# Altium schematic sheet main2020.SchDoc
size A1
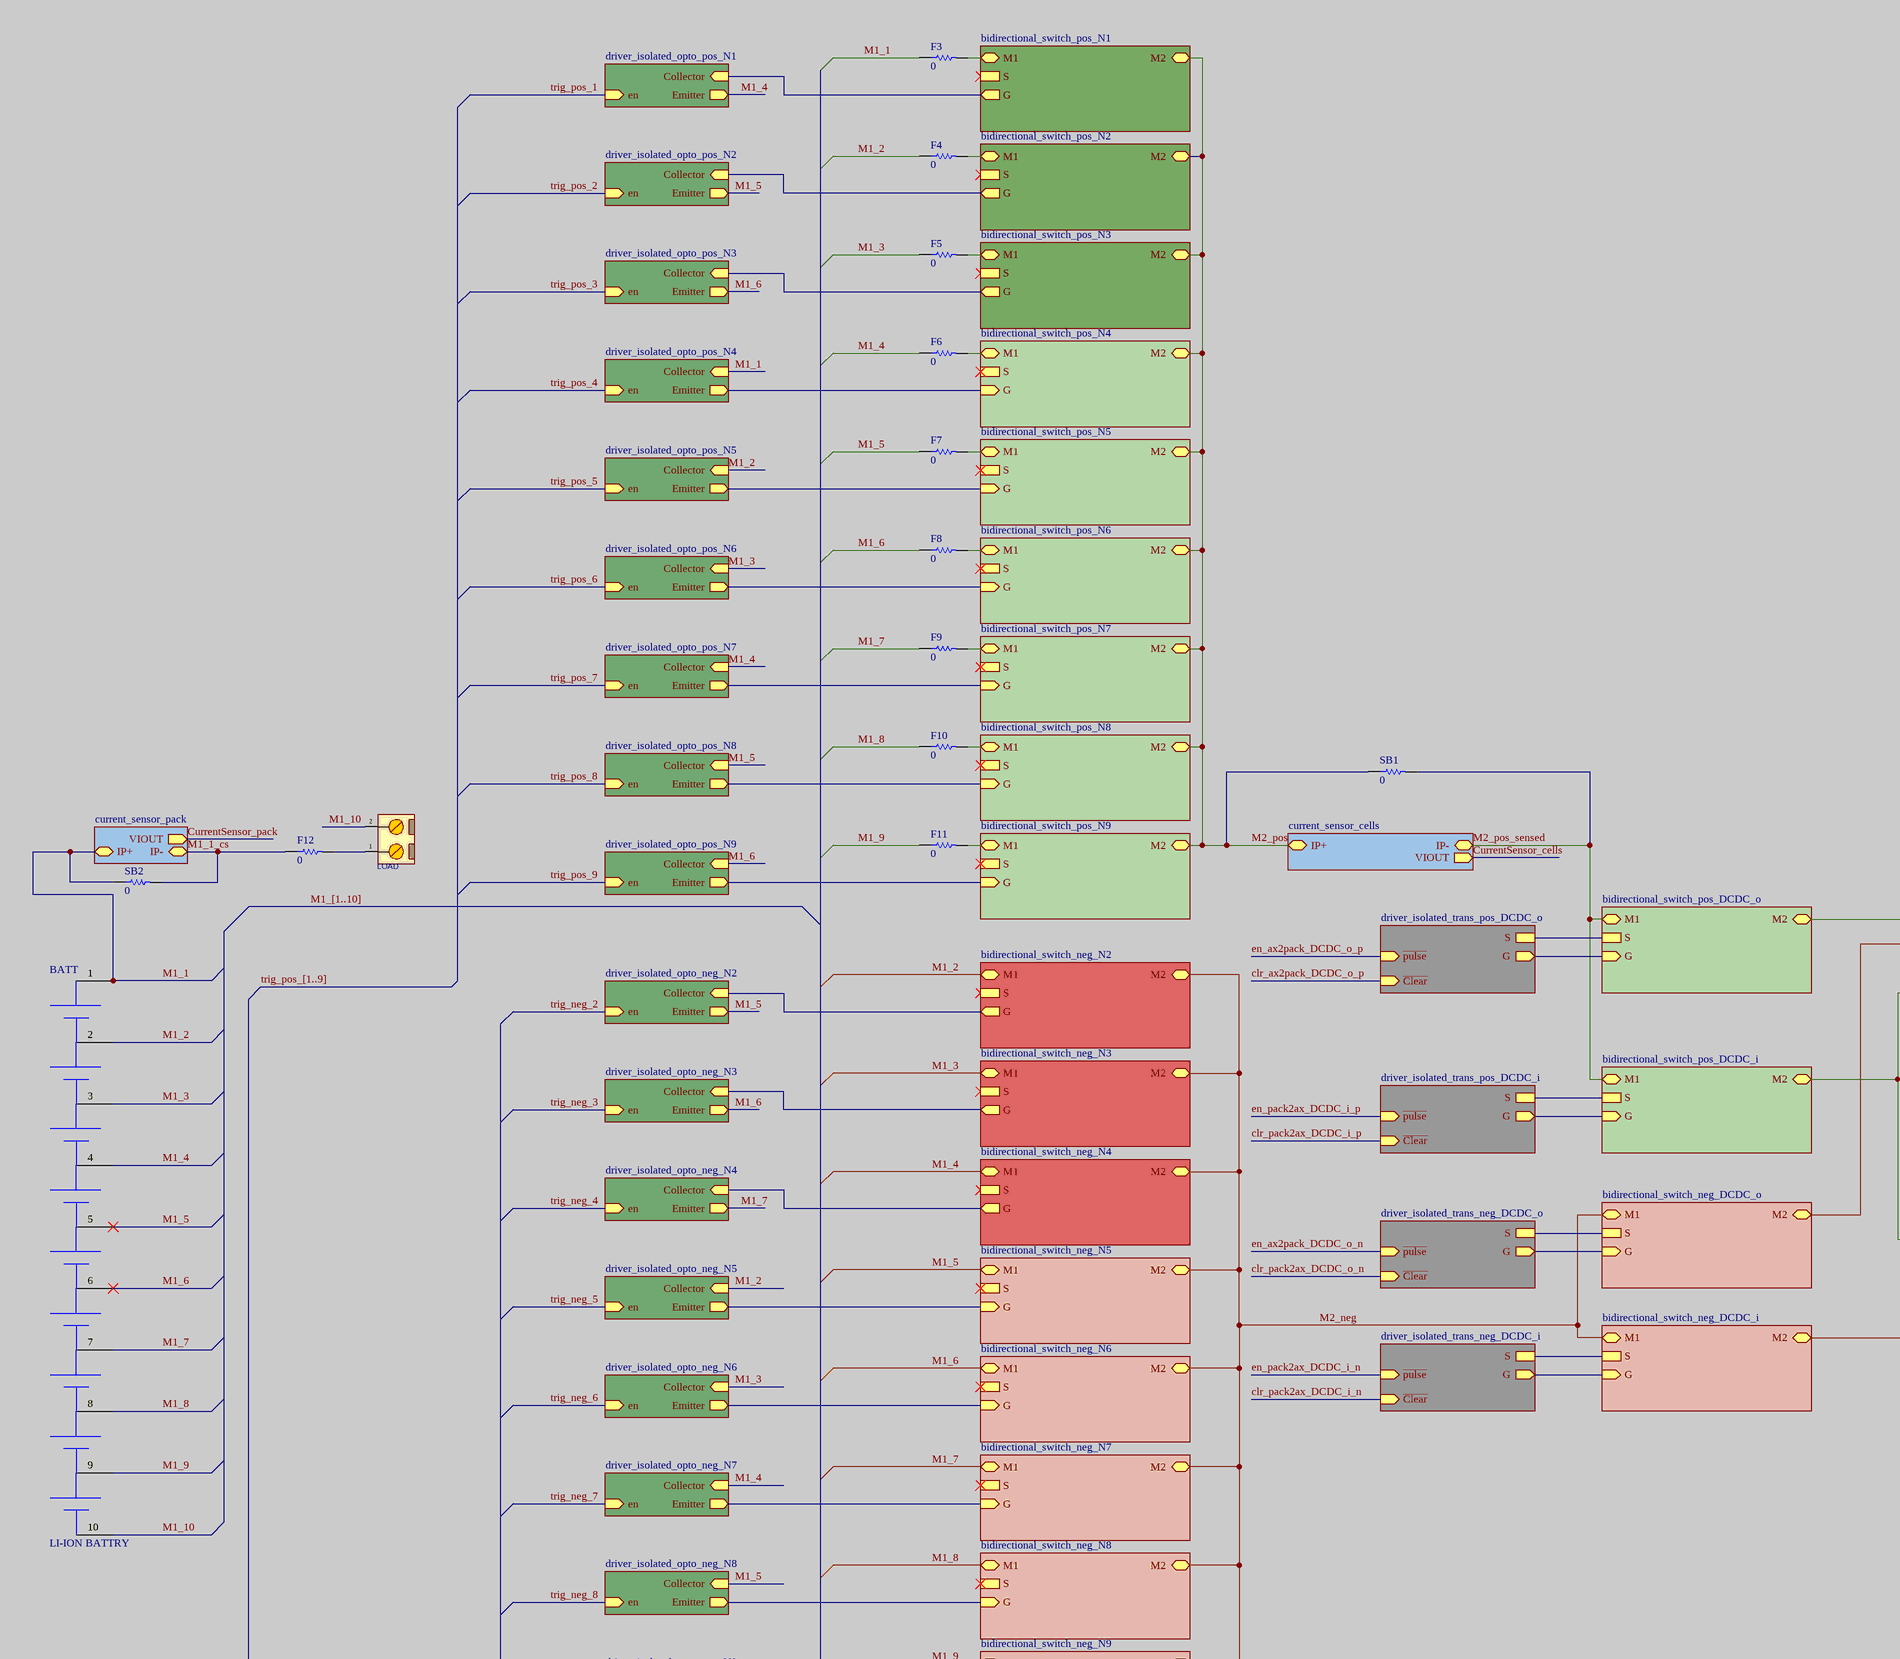
[diagram p0: main2020.SchDoc, top left]
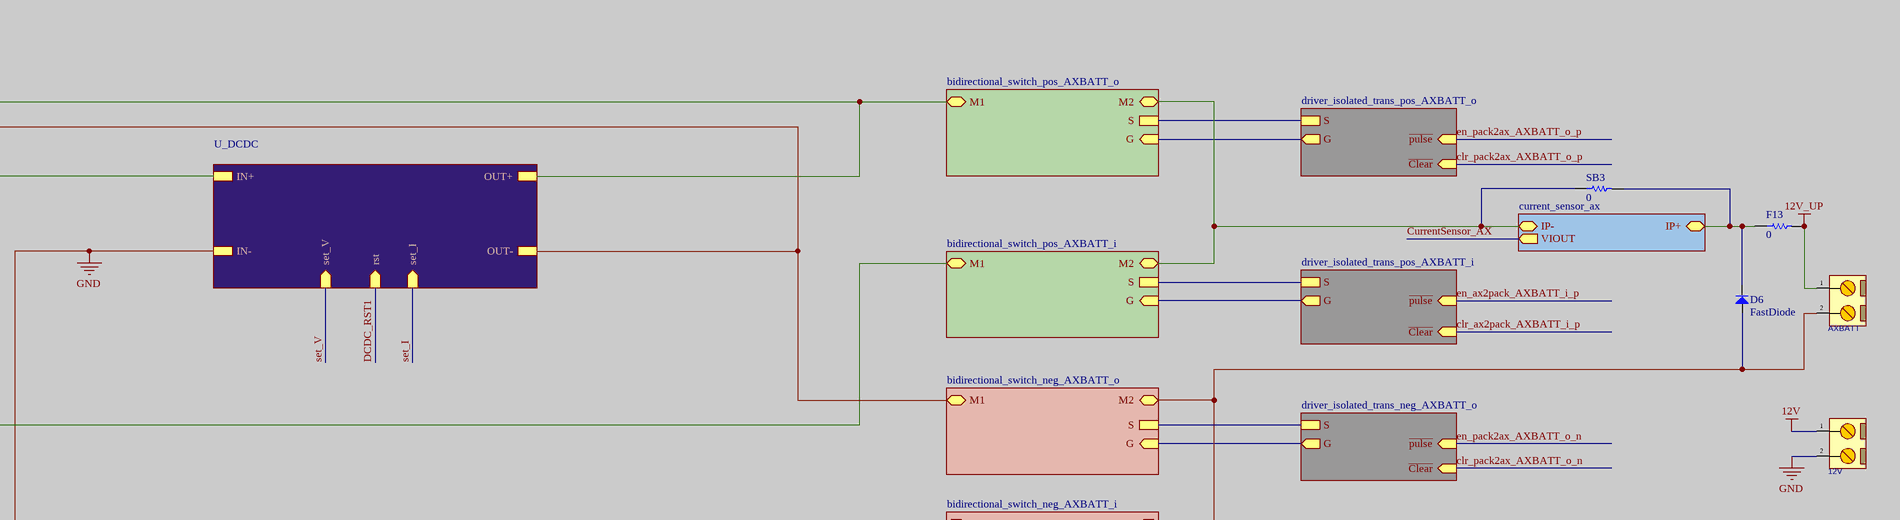
[diagram p1: main2020.SchDoc, top right]
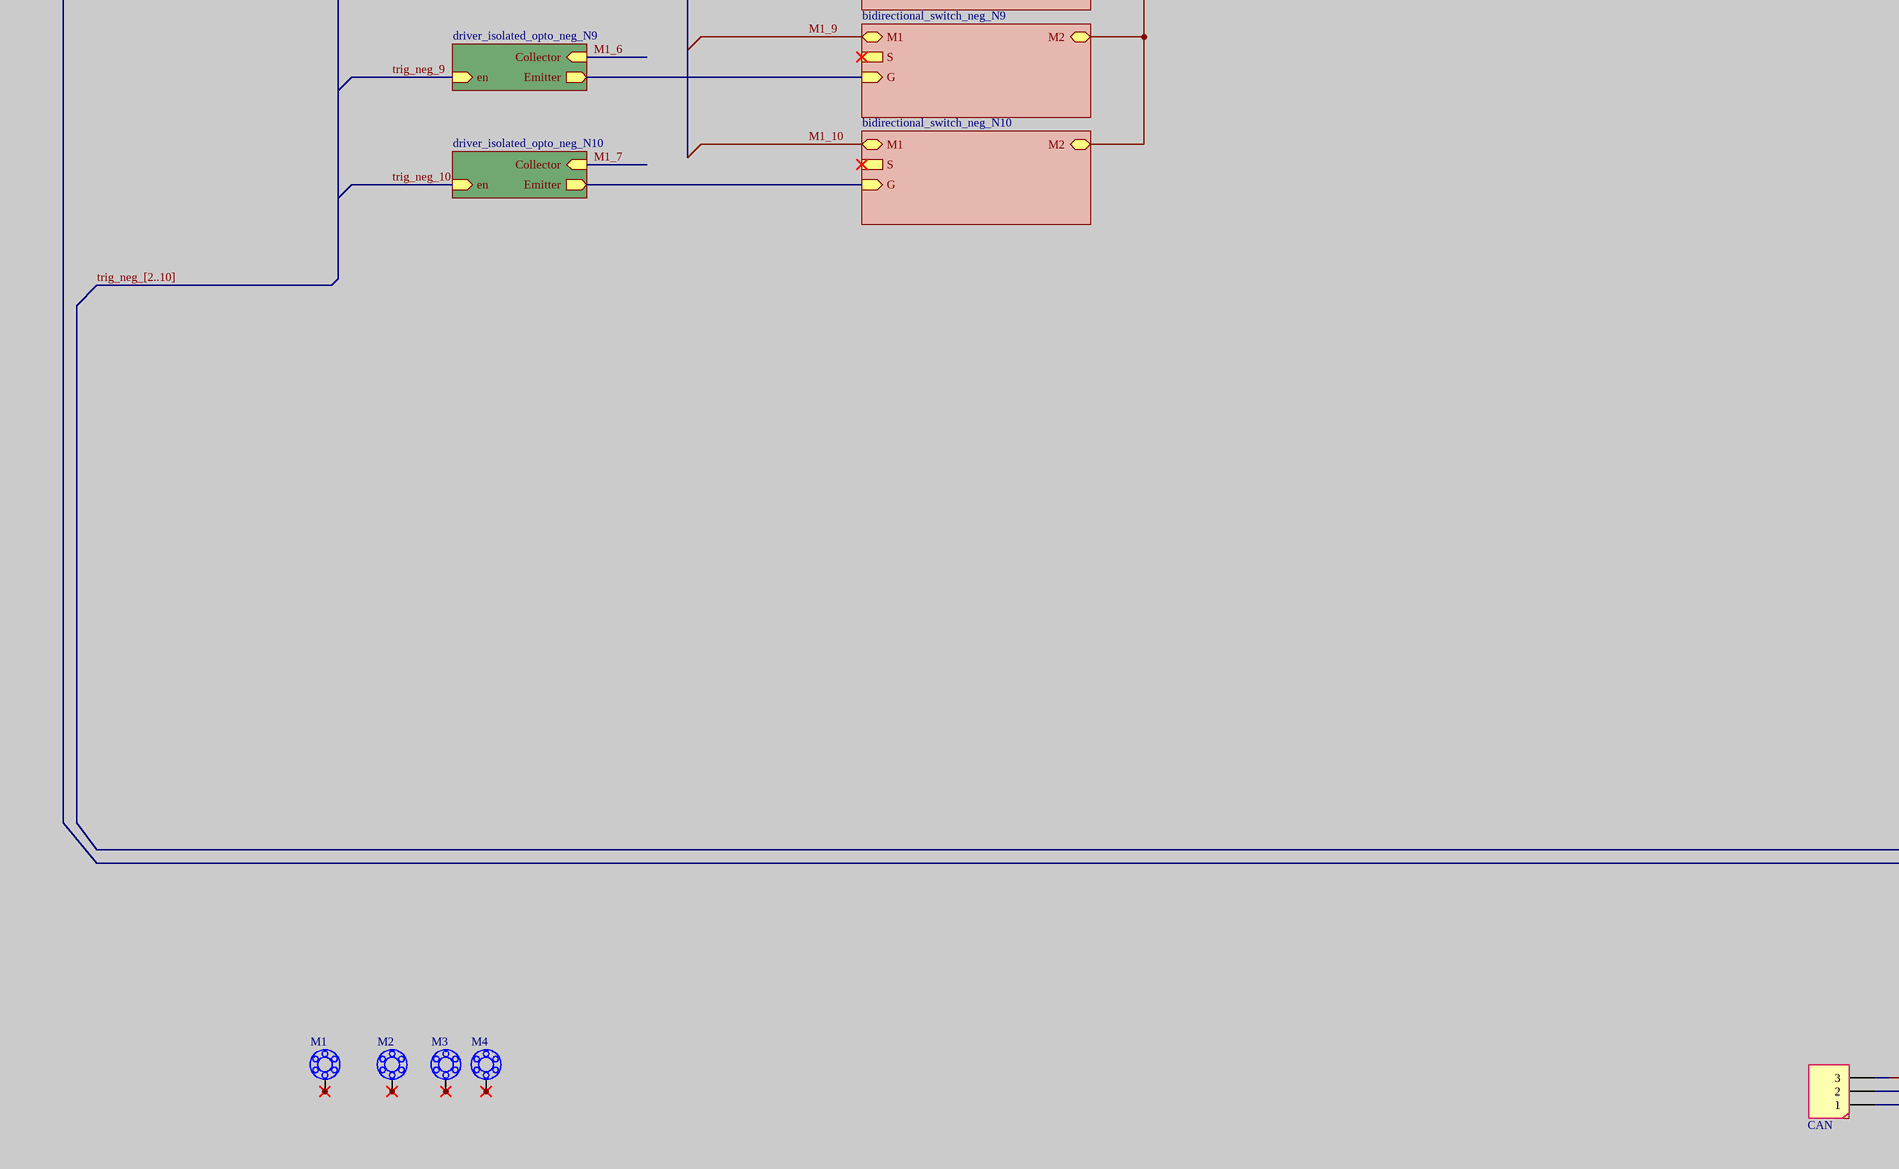
[diagram p2: main2020.SchDoc, bottom left]
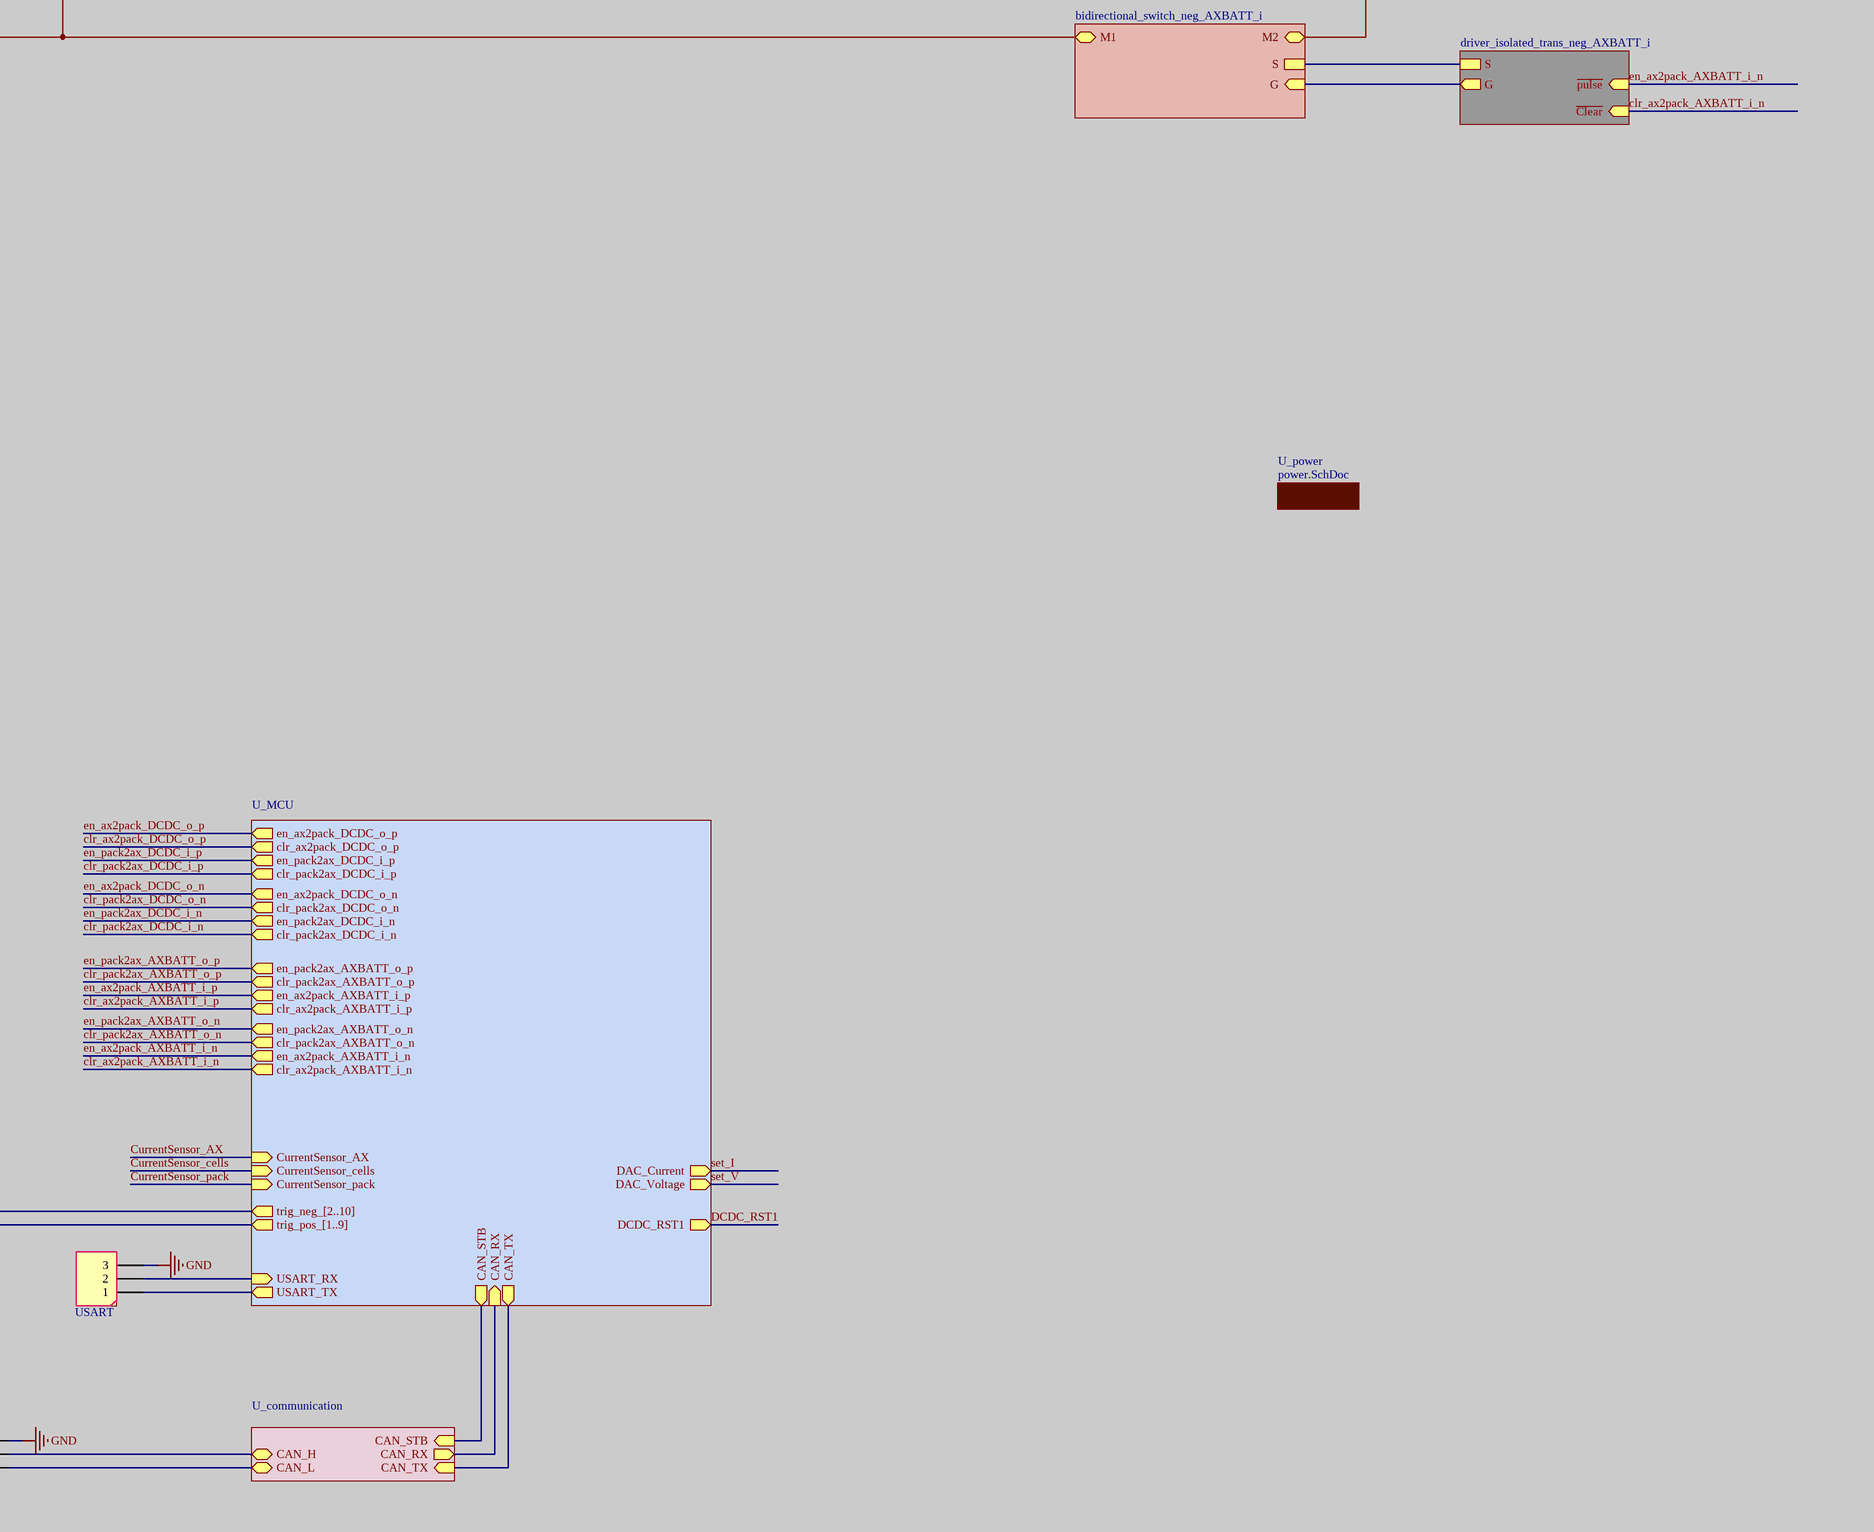
[diagram p3: main2020.SchDoc, bottom right]

## Parts
12V  CONN_TB8  [terminal block - 2828372]  (value not drawn)
AXBATT  CONN_TB8  [terminal block - 2828372]  (value not drawn)
BATT  LI-ION BATTRY  [terminal block - battery - 2828372 -]
CAN  DCDC_CTRL  [HEADER1*3]  (value not drawn)
D6  FastDiode  [FastDiode]
F3  0  [RESC0603]
F4  0  [RESC0603]
F5  0  [RESC0603]
F6  0  [RESC0603]
F7  0  [RESC0603]
F8  0  [RESC0603]
F9  0  [RESC0603]
F10  0  [RESC0603]
F11  0  [RESC0603]
F12  0  [RESC0603]
F13  0  [RESC0603]
LOAD  CONN_TB8  [terminal block - 2828372]  (value not drawn)
M1  M  [MOUNTING]  (value not drawn)  (no BOM)
M2  M  [MOUNTING]  (value not drawn)  (no BOM)
M3  M  [MOUNTING]  (value not drawn)  (no BOM)
M4  M  [MOUNTING]  (value not drawn)  (no BOM)
SB1  0  [RESC0603]
SB2  0  [RESC0603]
SB3  0  [RESC0603]
USART  DCDC_CTRL  [HEADER1*3]  (value not drawn)

## Sub-sheets
bidirectional_switch_neg_AXBATT_i = bidirectional_switch_N.SchDoc: M1 (bidir), M2 (bidir), G (in), S
bidirectional_switch_neg_AXBATT_o = bidirectional_switch_N.SchDoc: M1 (bidir), M2 (bidir), G (in), S
bidirectional_switch_neg_DCDC_i = bidirectional_switch_N.SchDoc: M1 (bidir), M2 (bidir), G (in), S
bidirectional_switch_neg_DCDC_o = bidirectional_switch_N.SchDoc: M1 (bidir), M2 (bidir), G (in), S
bidirectional_switch_neg_N2 = bidirectional_switch.SchDoc: M1 (bidir), M2 (bidir), S, G (out)
bidirectional_switch_neg_N3 = bidirectional_switch.SchDoc: M1 (bidir), M2 (bidir), S, G (out)
bidirectional_switch_neg_N4 = bidirectional_switch.SchDoc: M1 (bidir), M2 (bidir), S, G (out)
bidirectional_switch_neg_N5 = bidirectional_switch_N.SchDoc: M1 (bidir), M2 (bidir), G (in), S
bidirectional_switch_neg_N6 = bidirectional_switch_N.SchDoc: M1 (bidir), M2 (bidir), G (in), S
bidirectional_switch_neg_N7 = bidirectional_switch_N.SchDoc: M1 (bidir), M2 (bidir), G (in), S
bidirectional_switch_neg_N8 = bidirectional_switch_N.SchDoc: M1 (bidir), M2 (bidir), G (in), S
bidirectional_switch_neg_N9 = bidirectional_switch_N.SchDoc: M1 (bidir), M2 (bidir), G (in), S
bidirectional_switch_neg_N10 = bidirectional_switch_N.SchDoc: M1 (bidir), M2 (bidir), G (in), S
bidirectional_switch_pos_AXBATT_i = bidirectional_switch_N.SchDoc: M1 (bidir), M2 (bidir), G (in), S
bidirectional_switch_pos_AXBATT_o = bidirectional_switch_N.SchDoc: M1 (bidir), M2 (bidir), G (in), S
bidirectional_switch_pos_DCDC_i = bidirectional_switch_N.SchDoc: M1 (bidir), M2 (bidir), G (in), S
bidirectional_switch_pos_DCDC_o = bidirectional_switch_N.SchDoc: M1 (bidir), M2 (bidir), G (in), S
bidirectional_switch_pos_N1 = bidirectional_switch.SchDoc: M1 (bidir), M2 (bidir), S, G (out)
bidirectional_switch_pos_N2 = bidirectional_switch.SchDoc: M1 (bidir), M2 (bidir), S, G (out)
bidirectional_switch_pos_N3 = bidirectional_switch.SchDoc: M1 (bidir), M2 (bidir), S, G (out)
bidirectional_switch_pos_N4 = bidirectional_switch_N.SchDoc: M1 (bidir), M2 (bidir), G (in), S
bidirectional_switch_pos_N5 = bidirectional_switch_N.SchDoc: M1 (bidir), M2 (bidir), G (in), S
bidirectional_switch_pos_N6 = bidirectional_switch_N.SchDoc: M1 (bidir), M2 (bidir), G (in), S
bidirectional_switch_pos_N7 = bidirectional_switch_N.SchDoc: M1 (bidir), M2 (bidir), G (in), S
bidirectional_switch_pos_N8 = bidirectional_switch_N.SchDoc: M1 (bidir), M2 (bidir), G (in), S
bidirectional_switch_pos_N9 = bidirectional_switch_N.SchDoc: M1 (bidir), M2 (bidir), G (in), S
current_sensor_ax = current_sensor.SchDoc: IP+ (bidir), IP- (bidir), VIOUT (out)
current_sensor_cells = current_sensor.SchDoc: IP+ (bidir), IP- (bidir), VIOUT (out)
current_sensor_pack = current_sensor.SchDoc: IP+ (bidir), IP- (bidir), VIOUT (out)
driver_isolated_opto_neg_N2 = driver_isolated_opto.SchDoc: en (in), Emitter (out), Collector (in)
driver_isolated_opto_neg_N3 = driver_isolated_opto.SchDoc: en (in), Emitter (out), Collector (in)
driver_isolated_opto_neg_N4 = driver_isolated_opto.SchDoc: en (in), Emitter (out), Collector (in)
driver_isolated_opto_neg_N5 = driver_isolated_opto.SchDoc: en (in), Emitter (out), Collector (in)
driver_isolated_opto_neg_N6 = driver_isolated_opto.SchDoc: en (in), Emitter (out), Collector (in)
driver_isolated_opto_neg_N7 = driver_isolated_opto.SchDoc: en (in), Emitter (out), Collector (in)
driver_isolated_opto_neg_N8 = driver_isolated_opto.SchDoc: en (in), Emitter (out), Collector (in)
driver_isolated_opto_neg_N9 = driver_isolated_opto.SchDoc: en (in), Emitter (out), Collector (in)
driver_isolated_opto_neg_N10 = driver_isolated_opto.SchDoc: en (in), Emitter (out), Collector (in)
driver_isolated_opto_pos_N1 = driver_isolated_opto.SchDoc: en (in), Emitter (out), Collector (in)
driver_isolated_opto_pos_N2 = driver_isolated_opto.SchDoc: en (in), Emitter (out), Collector (in)
driver_isolated_opto_pos_N3 = driver_isolated_opto.SchDoc: en (in), Emitter (out), Collector (in)
driver_isolated_opto_pos_N4 = driver_isolated_opto.SchDoc: en (in), Emitter (out), Collector (in)
driver_isolated_opto_pos_N5 = driver_isolated_opto.SchDoc: en (in), Emitter (out), Collector (in)
driver_isolated_opto_pos_N6 = driver_isolated_opto.SchDoc: en (in), Emitter (out), Collector (in)
driver_isolated_opto_pos_N7 = driver_isolated_opto.SchDoc: en (in), Emitter (out), Collector (in)
driver_isolated_opto_pos_N8 = driver_isolated_opto.SchDoc: en (in), Emitter (out), Collector (in)
driver_isolated_opto_pos_N9 = driver_isolated_opto.SchDoc: en (in), Emitter (out), Collector (in)
driver_isolated_trans_neg_AXBATT_i = driver_isolated_trans.SchDoc: ~{pulse} (in), G (out), S, ~{Clear} (in)
driver_isolated_trans_neg_AXBATT_o = driver_isolated_trans.SchDoc: ~{pulse} (in), G (out), S, ~{Clear} (in)
driver_isolated_trans_neg_DCDC_i = driver_isolated_trans.SchDoc: ~{pulse} (in), G (out), S, ~{Clear} (in)
driver_isolated_trans_neg_DCDC_o = driver_isolated_trans.SchDoc: ~{pulse} (in), G (out), S, ~{Clear} (in)
driver_isolated_trans_pos_AXBATT_i = driver_isolated_trans.SchDoc: ~{pulse} (in), G (out), S, ~{Clear} (in)
driver_isolated_trans_pos_AXBATT_o = driver_isolated_trans.SchDoc: ~{pulse} (in), G (out), S, ~{Clear} (in)
driver_isolated_trans_pos_DCDC_i = driver_isolated_trans.SchDoc: ~{pulse} (in), G (out), S, ~{Clear} (in)
driver_isolated_trans_pos_DCDC_o = driver_isolated_trans.SchDoc: ~{pulse} (in), G (out), S, ~{Clear} (in)
U_communication = communication.SchDoc: CAN_TX (in), CAN_RX (out), CAN_H (bidir), CAN_L (bidir), CAN_STB (in)
U_DCDC = DCDC.SchDoc: IN+, IN-, OUT+, OUT-, set_V (in), set_I (in), rst (in)
U_MCU = MCU.SchDoc: DAC_Current (out), DAC_Voltage (out), USART_TX (out), USART_RX (in), DCDC_RST1 (out), CAN_TX (out), CAN_RX (in), CAN_STB (out), trig_pos_[1..9] (out), trig_neg_[2..10] (out), CurrentSensor_AX (in), CurrentSensor_cells (in), CurrentSensor_pack (in), en_ax2pack_DCDC_o_p (out), clr_ax2pack_DCDC_o_p (out), en_pack2ax_DCDC_i_p (out), clr_pack2ax_DCDC_i_p (out), en_ax2pack_DCDC_o_n (out), clr_pack2ax_DCDC_o_n (out), en_pack2ax_DCDC_i_n (out), clr_pack2ax_DCDC_i_n (out), en_pack2ax_AXBATT_o_p (out), clr_pack2ax_AXBATT_o_p (out), en_ax2pack_AXBATT_i_p (out), clr_ax2pack_AXBATT_i_p (out), en_pack2ax_AXBATT_o_n (out), clr_pack2ax_AXBATT_o_n (out), en_ax2pack_AXBATT_i_n (out), clr_ax2pack_AXBATT_i_n (out)
U_power = power.SchDoc: no entries

## Nets
12V: 12V.1
12V_UP: AXBATT.1 F13.2
GND: 12V.2 CAN.3 USART.3 ; sheet U_DCDC/IN-, sheet bidirectional_switch_neg_DCDC_i/M2, sheet bidirectional_switch_neg_AXBATT_i/M1
clr_ax2pack_AXBATT_i_n: sheet U_MCU/clr_ax2pack_AXBATT_i_n, sheet driver_isolated_trans_neg_AXBATT_i/~{Clear}
clr_ax2pack_AXBATT_i_p: sheet U_MCU/clr_ax2pack_AXBATT_i_p, sheet driver_isolated_trans_pos_AXBATT_i/~{Clear}
clr_ax2pack_DCDC_o_p: sheet U_MCU/clr_ax2pack_DCDC_o_p, sheet driver_isolated_trans_pos_DCDC_o/~{Clear}
clr_pack2ax_AXBATT_o_n: sheet U_MCU/clr_pack2ax_AXBATT_o_n, sheet driver_isolated_trans_neg_AXBATT_o/~{Clear}
clr_pack2ax_AXBATT_o_p: sheet U_MCU/clr_pack2ax_AXBATT_o_p, sheet driver_isolated_trans_pos_AXBATT_o/~{Clear}
clr_pack2ax_DCDC_i_n: sheet U_MCU/clr_pack2ax_DCDC_i_n, sheet driver_isolated_trans_neg_DCDC_i/~{Clear}
clr_pack2ax_DCDC_i_p: sheet U_MCU/clr_pack2ax_DCDC_i_p, sheet driver_isolated_trans_pos_DCDC_i/~{Clear}
clr_pack2ax_DCDC_o_n: sheet U_MCU/clr_pack2ax_DCDC_o_n, sheet driver_isolated_trans_neg_DCDC_o/~{Clear}
CurrentSensor_AX: sheet current_sensor_ax/VIOUT, sheet U_MCU/CurrentSensor_AX
CurrentSensor_cells: sheet current_sensor_cells/VIOUT, sheet U_MCU/CurrentSensor_cells
CurrentSensor_pack: sheet U_MCU/CurrentSensor_pack, sheet current_sensor_pack/VIOUT
DCDC_RST1: sheet U_MCU/DCDC_RST1, sheet U_DCDC/rst
en_ax2pack_AXBATT_i_n: sheet U_MCU/en_ax2pack_AXBATT_i_n, sheet driver_isolated_trans_neg_AXBATT_i/~{pulse}
en_ax2pack_AXBATT_i_p: sheet U_MCU/en_ax2pack_AXBATT_i_p, sheet driver_isolated_trans_pos_AXBATT_i/~{pulse}
en_ax2pack_DCDC_o_n: sheet U_MCU/en_ax2pack_DCDC_o_n, sheet driver_isolated_trans_neg_DCDC_o/~{pulse}
en_ax2pack_DCDC_o_p: sheet U_MCU/en_ax2pack_DCDC_o_p, sheet driver_isolated_trans_pos_DCDC_o/~{pulse}
en_pack2ax_AXBATT_o_n: sheet U_MCU/en_pack2ax_AXBATT_o_n, sheet driver_isolated_trans_neg_AXBATT_o/~{pulse}
en_pack2ax_AXBATT_o_p: sheet U_MCU/en_pack2ax_AXBATT_o_p, sheet driver_isolated_trans_pos_AXBATT_o/~{pulse}
en_pack2ax_DCDC_i_n: sheet U_MCU/en_pack2ax_DCDC_i_n, sheet driver_isolated_trans_neg_DCDC_i/~{pulse}
en_pack2ax_DCDC_i_p: sheet U_MCU/en_pack2ax_DCDC_i_p, sheet driver_isolated_trans_pos_DCDC_i/~{pulse}
M1_1: BATT.1 F3.1 SB2.1 ; sheet current_sensor_pack/IP+, sheet driver_isolated_opto_pos_N4/Collector
M1_1_cs: F12.1 SB2.2 ; sheet current_sensor_pack/IP-
M1_2: BATT.2 F4.1 ; sheet driver_isolated_opto_pos_N5/Collector, sheet driver_isolated_opto_neg_N5/Collector, sheet bidirectional_switch_neg_N2/M1
M1_3: BATT.3 F5.1 ; sheet driver_isolated_opto_pos_N6/Collector, sheet driver_isolated_opto_neg_N6/Collector, sheet bidirectional_switch_neg_N3/M1
M1_4: BATT.4 F6.1 ; sheet driver_isolated_opto_pos_N7/Collector, sheet driver_isolated_opto_neg_N7/Collector, sheet driver_isolated_opto_pos_N1/Emitter, sheet bidirectional_switch_neg_N4/M1
M1_5: BATT.5 F7.1 ; sheet bidirectional_switch_neg_N5/M1, sheet driver_isolated_opto_pos_N8/Collector, sheet driver_isolated_opto_neg_N8/Collector, sheet driver_isolated_opto_pos_N2/Emitter, sheet driver_isolated_opto_neg_N2/Emitter
M1_6: BATT.6 F8.1 ; sheet bidirectional_switch_neg_N6/M1, sheet driver_isolated_opto_pos_N9/Collector, sheet driver_isolated_opto_neg_N9/Collector, sheet driver_isolated_opto_pos_N3/Emitter, sheet driver_isolated_opto_neg_N3/Emitter
M1_7: BATT.7 F9.1 ; sheet bidirectional_switch_neg_N7/M1, sheet driver_isolated_opto_neg_N10/Collector, sheet driver_isolated_opto_neg_N4/Emitter
M1_8: BATT.8 F10.1 ; sheet bidirectional_switch_neg_N8/M1
M1_9: BATT.9 F11.1 ; sheet bidirectional_switch_neg_N9/M1
M1_10: BATT.10 LOAD.2 ; sheet bidirectional_switch_neg_N10/M1
M2_neg: sheet bidirectional_switch_neg_N5/M2, sheet bidirectional_switch_neg_N6/M2, sheet bidirectional_switch_neg_N7/M2, sheet bidirectional_switch_neg_N8/M2, sheet bidirectional_switch_neg_N9/M2, sheet bidirectional_switch_neg_N10/M2, sheet bidirectional_switch_neg_N2/M2, sheet bidirectional_switch_neg_N3/M2, sheet bidirectional_switch_neg_N4/M2, sheet bidirectional_switch_neg_DCDC_o/M1, sheet bidirectional_switch_neg_DCDC_i/M1
M2_pos: SB1.1 ; sheet current_sensor_cells/IP+, sheet bidirectional_switch_pos_N4/M2, sheet bidirectional_switch_pos_N5/M2, sheet bidirectional_switch_pos_N6/M2, sheet bidirectional_switch_pos_N7/M2, sheet bidirectional_switch_pos_N8/M2, sheet bidirectional_switch_pos_N9/M2, sheet bidirectional_switch_pos_N1/M2, sheet bidirectional_switch_pos_N2/M2, sheet bidirectional_switch_pos_N3/M2
M2_pos_sensed: SB1.2 ; sheet current_sensor_cells/IP-, sheet bidirectional_switch_pos_DCDC_o/M1, sheet bidirectional_switch_pos_DCDC_i/M1
set_I: sheet U_MCU/DAC_Current, sheet U_DCDC/set_I
set_V: sheet U_MCU/DAC_Voltage, sheet U_DCDC/set_V
trig_neg_2: sheet driver_isolated_opto_neg_N2/en
trig_neg_3: sheet driver_isolated_opto_neg_N3/en
trig_neg_4: sheet driver_isolated_opto_neg_N4/en
trig_neg_5: sheet driver_isolated_opto_neg_N5/en
trig_neg_6: sheet driver_isolated_opto_neg_N6/en
trig_neg_7: sheet driver_isolated_opto_neg_N7/en
trig_neg_8: sheet driver_isolated_opto_neg_N8/en
trig_neg_9: sheet driver_isolated_opto_neg_N9/en
trig_neg_10: sheet driver_isolated_opto_neg_N10/en
trig_pos_1: sheet driver_isolated_opto_pos_N1/en
trig_pos_2: sheet driver_isolated_opto_pos_N2/en
trig_pos_3: sheet driver_isolated_opto_pos_N3/en
trig_pos_4: sheet driver_isolated_opto_pos_N4/en
trig_pos_5: sheet driver_isolated_opto_pos_N5/en
trig_pos_6: sheet driver_isolated_opto_pos_N6/en
trig_pos_7: sheet driver_isolated_opto_pos_N7/en
trig_pos_8: sheet driver_isolated_opto_pos_N8/en
trig_pos_9: sheet driver_isolated_opto_pos_N9/en
NetAXBATT_2: AXBATT.2 D6.1(A) ; sheet bidirectional_switch_neg_AXBATT_o/M2, sheet bidirectional_switch_neg_AXBATT_i/M2
NetCAN_1: CAN.1 ; sheet U_communication/CAN_L
NetCAN_2: CAN.2 ; sheet U_communication/CAN_H
NetD6_2: D6.2(K) F13.1 SB3.2 ; sheet current_sensor_ax/IP+
NetF3_2: F3.2 ; sheet bidirectional_switch_pos_N1/M1
NetF4_2: F4.2 ; sheet bidirectional_switch_pos_N2/M1
NetF5_2: F5.2 ; sheet bidirectional_switch_pos_N3/M1
NetF6_2: F6.2 ; sheet bidirectional_switch_pos_N4/M1
NetF7_2: F7.2 ; sheet bidirectional_switch_pos_N5/M1
NetF8_2: F8.2 ; sheet bidirectional_switch_pos_N6/M1
NetF9_2: F9.2 ; sheet bidirectional_switch_pos_N7/M1
NetF10_2: F10.2 ; sheet bidirectional_switch_pos_N8/M1
NetF11_2: F11.2 ; sheet bidirectional_switch_pos_N9/M1
NetF12_2: F12.2 LOAD.1
NetM1_1: M1.1 M1.2 M1.3 M1.4 M1.5 M1.6 M1.7
NetM2_1: M2.1 M2.2 M2.3 M2.4 M2.5 M2.6 M2.7
NetM3_1: M3.1 M3.2 M3.3 M3.4 M3.5 M3.6 M3.7
NetM4_1: M4.1 M4.2 M4.3 M4.4 M4.5 M4.6 M4.7
NetSB3_1: SB3.1 ; sheet current_sensor_ax/IP-, sheet bidirectional_switch_pos_AXBATT_i/M2, sheet bidirectional_switch_pos_AXBATT_o/M2
NetUSART_1: USART.1 ; sheet U_MCU/USART_TX
NetUSART_2: USART.2 ; sheet U_MCU/USART_RX
(unnamed): sheet U_MCU/CAN_TX, sheet U_communication/CAN_TX
(unnamed): sheet U_MCU/CAN_RX, sheet U_communication/CAN_RX
(unnamed): sheet U_MCU/CAN_STB, sheet U_communication/CAN_STB
(unnamed): sheet U_DCDC/IN+, sheet bidirectional_switch_pos_AXBATT_i/M1, sheet bidirectional_switch_pos_DCDC_i/M2
(unnamed): sheet U_DCDC/OUT+, sheet bidirectional_switch_pos_DCDC_o/M2, sheet bidirectional_switch_pos_AXBATT_o/M1
(unnamed): sheet U_DCDC/OUT-, sheet bidirectional_switch_neg_DCDC_o/M2, sheet bidirectional_switch_neg_AXBATT_o/M1
(unnamed): sheet bidirectional_switch_pos_N4/G, sheet driver_isolated_opto_pos_N4/Emitter
(unnamed): sheet bidirectional_switch_pos_N5/G, sheet driver_isolated_opto_pos_N5/Emitter
(unnamed): sheet bidirectional_switch_pos_N6/G, sheet driver_isolated_opto_pos_N6/Emitter
(unnamed): sheet bidirectional_switch_pos_N7/G, sheet driver_isolated_opto_pos_N7/Emitter
(unnamed): sheet bidirectional_switch_pos_N8/G, sheet driver_isolated_opto_pos_N8/Emitter
(unnamed): sheet bidirectional_switch_pos_N9/G, sheet driver_isolated_opto_pos_N9/Emitter
(unnamed): sheet bidirectional_switch_neg_N5/G, sheet driver_isolated_opto_neg_N5/Emitter
(unnamed): sheet bidirectional_switch_neg_N6/G, sheet driver_isolated_opto_neg_N6/Emitter
(unnamed): sheet bidirectional_switch_neg_N7/G, sheet driver_isolated_opto_neg_N7/Emitter
(unnamed): sheet bidirectional_switch_neg_N8/G, sheet driver_isolated_opto_neg_N8/Emitter
(unnamed): sheet bidirectional_switch_neg_N9/G, sheet driver_isolated_opto_neg_N9/Emitter
(unnamed): sheet bidirectional_switch_neg_N10/G, sheet driver_isolated_opto_neg_N10/Emitter
(unnamed): sheet bidirectional_switch_pos_DCDC_o/G, sheet driver_isolated_trans_pos_DCDC_o/G
(unnamed): sheet bidirectional_switch_pos_DCDC_o/S, sheet driver_isolated_trans_pos_DCDC_o/S
(unnamed): sheet driver_isolated_trans_pos_AXBATT_i/G, sheet bidirectional_switch_pos_AXBATT_i/G
(unnamed): sheet driver_isolated_trans_pos_AXBATT_i/S, sheet bidirectional_switch_pos_AXBATT_i/S
(unnamed): sheet driver_isolated_trans_pos_DCDC_i/G, sheet bidirectional_switch_pos_DCDC_i/G
(unnamed): sheet driver_isolated_trans_pos_DCDC_i/S, sheet bidirectional_switch_pos_DCDC_i/S
(unnamed): sheet driver_isolated_trans_pos_AXBATT_o/G, sheet bidirectional_switch_pos_AXBATT_o/G
(unnamed): sheet driver_isolated_trans_pos_AXBATT_o/S, sheet bidirectional_switch_pos_AXBATT_o/S
(unnamed): sheet driver_isolated_opto_pos_N3/Collector, sheet bidirectional_switch_pos_N3/G
(unnamed): sheet driver_isolated_opto_pos_N2/Collector, sheet bidirectional_switch_pos_N2/G
(unnamed): sheet driver_isolated_opto_pos_N1/Collector, sheet bidirectional_switch_pos_N1/G
(unnamed): sheet driver_isolated_opto_neg_N4/Collector, sheet bidirectional_switch_neg_N4/G
(unnamed): sheet driver_isolated_opto_neg_N3/Collector, sheet bidirectional_switch_neg_N3/G
(unnamed): sheet driver_isolated_opto_neg_N2/Collector, sheet bidirectional_switch_neg_N2/G
(unnamed): sheet bidirectional_switch_neg_DCDC_o/G, sheet driver_isolated_trans_neg_DCDC_o/G
(unnamed): sheet bidirectional_switch_neg_DCDC_o/S, sheet driver_isolated_trans_neg_DCDC_o/S
(unnamed): sheet bidirectional_switch_neg_DCDC_i/G, sheet driver_isolated_trans_neg_DCDC_i/G
(unnamed): sheet bidirectional_switch_neg_DCDC_i/S, sheet driver_isolated_trans_neg_DCDC_i/S
(unnamed): sheet bidirectional_switch_neg_AXBATT_o/G, sheet driver_isolated_trans_neg_AXBATT_o/G
(unnamed): sheet bidirectional_switch_neg_AXBATT_o/S, sheet driver_isolated_trans_neg_AXBATT_o/S
(unnamed): sheet bidirectional_switch_neg_AXBATT_i/G, sheet driver_isolated_trans_neg_AXBATT_i/G
(unnamed): sheet bidirectional_switch_neg_AXBATT_i/S, sheet driver_isolated_trans_neg_AXBATT_i/S

## Buses and harness runs
bus M1_[1..10]
bus trig_neg_[2..10] = sheet U_MCU/trig_neg_[2..10]
bus trig_pos_[1..9] = sheet U_MCU/trig_pos_[1..9]

## Library data of the parts
12V AXBATT LOAD = TERMINAL_BLOCK 1 × 2: CONN, TERMINAL BLOCK, 5.08mm pitch; VALUE: CONN_TB8
BATT = BATTRY_pack
CAN USART = Header1*3: Header, 3-Pin; LatestRevisionDate: 17-Jul-2002; LatestRevisionNote: Re-released for DXP Platform.; Publisher: Altium Limited
F3-F13 SB1-SB3 = Resistor: 0603,0.1W; Published: 8-Jun-2000; LatestRevisionDate: 17-Jul-2002; LatestRevisionNote: Re-released for DXP Platform.; PackageReference: AXIAL-0.5; Publisher: Altium Limited; Value: 0
M1-M4 = MOUNTING
D6 = FastDiode: Published: 8-Jun-2000; LatestRevisionDate: 17-Dec-2003; LatestRevisionNote: PCB Footprint replaced.; DatasheetDocument: 16-Apr-2002; PackageDocument: 16-Apr-2002; PackageReference: 3.5X2.8X1.9; Publisher: Altium Limited